# Altium schematic sheet FI_10_7.SchDoc
size A4
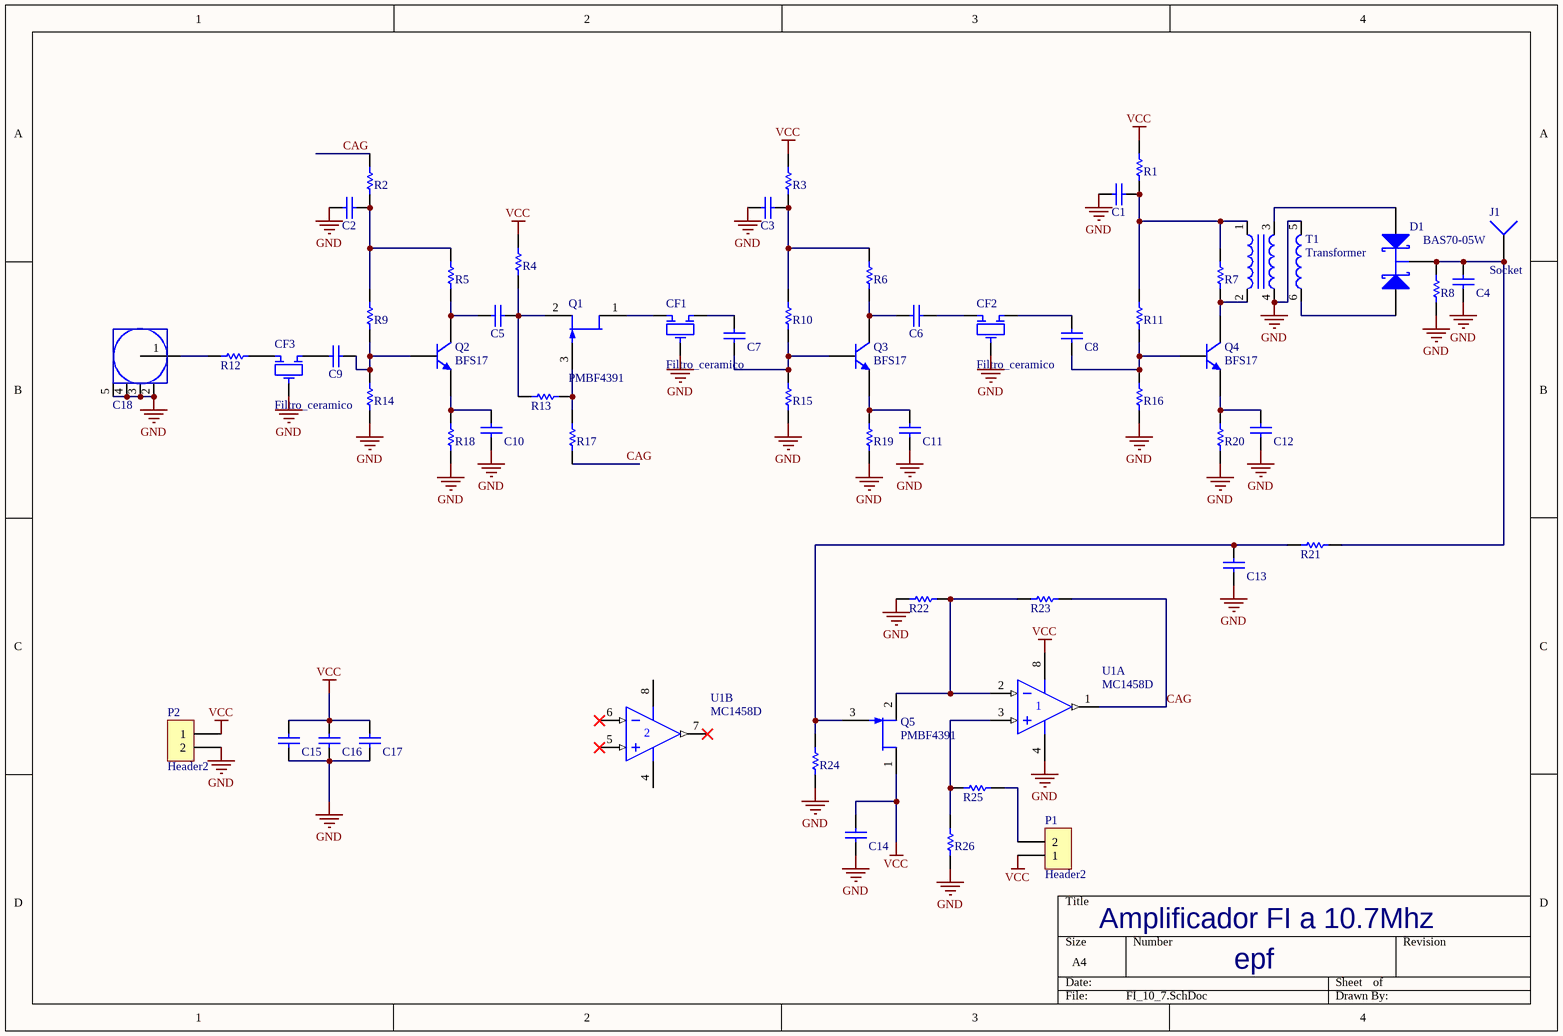
[diagram p0: FI_10_7.SchDoc]

## Parts
C1  Capacitor  [0805_CAP]  (value not drawn)
C2  Capacitor  [0805_CAP]  (value not drawn)
C3  Capacitor  [0805_CAP]  (value not drawn)
C4  Capacitor  [0805_CAP]  (value not drawn)
C5  Capacitor  [0805_CAP]  (value not drawn)
C6  Capacitor  [0805_CAP]  (value not drawn)
C7  Capacitor  [0805_CAP]  (value not drawn)
C8  Capacitor  [0805_CAP]  (value not drawn)
C9  Capacitor  [0805_CAP]  (value not drawn)
C10  Capacitor  [0805_CAP]  (value not drawn)
C11  Capacitor  [0805_CAP]  (value not drawn)
C12  Capacitor  [0805_CAP]  (value not drawn)
C13  Capacitor  [0805_CAP]  (value not drawn)
C14  Capacitor  [0805_CAP]  (value not drawn)
C15  Capacitor  [0805_CAP]  (value not drawn)
C16  Capacitor  [0805_CAP]  (value not drawn)
C17  Capacitor  [0805_CAP]  (value not drawn)
C18  SMA  [SMAL2]  (value not drawn)
CF1  Filtro_ceramico  [Filter_10_7]
CF2  Filtro_ceramico  [Filter_10_7]
CF3  Filtro_ceramico  [Filter_10_7]
D1  BAS70-05W  [SOT323_N]
J1  Socket  [PIN1]
P1  Header2  [Header2Hembra]
P2  Header2  [Header2Hembra]
Q1  PMBF4391  [SOT23]
Q2  BFS17  [SOT23]
Q3  BFS17  [SOT23]
Q4  BFS17  [SOT23]
Q5  PMBF4391  [SOT23]
R1  Resistor  [0805_RES]  (value not drawn)
R2  Resistor  [0805_RES]  (value not drawn)
R3  Resistor  [0805_RES]  (value not drawn)
R4  Resistor  [0805_RES]  (value not drawn)
R5  Resistor  [0805_RES]  (value not drawn)
R6  Resistor  [0805_RES]  (value not drawn)
R7  Resistor  [0805_RES]  (value not drawn)
R8  Resistor  [0805_RES]  (value not drawn)
R9  Resistor  [0805_RES]  (value not drawn)
R10  Resistor  [0805_RES]  (value not drawn)
R11  Resistor  [0805_RES]  (value not drawn)
R12  Resistor  [0805_RES]  (value not drawn)
R13  Resistor  [0805_RES]  (value not drawn)
R14  Resistor  [0805_RES]  (value not drawn)
R15  Resistor  [0805_RES]  (value not drawn)
R16  Resistor  [0805_RES]  (value not drawn)
R17  Resistor  [0805_RES]  (value not drawn)
R18  Resistor  [0805_RES]  (value not drawn)
R19  Resistor  [0805_RES]  (value not drawn)
R20  Resistor  [0805_RES]  (value not drawn)
R21  Resistor  [0805_RES]  (value not drawn)
R22  Resistor  [0805_RES]  (value not drawn)
R23  Resistor  [0805_RES]  (value not drawn)
R24  Resistor  [0805_RES]  (value not drawn)
R25  Resistor  [0805_RES]  (value not drawn)
R26  Resistor  [0805_RES]  (value not drawn)
T1  Transformer  [NTH12_V_3Ind_2]
U1  MC1458D  [751-05_M]  (parts A,B of 2)

## Nets
GND: C1.2 C2.2 C3.2 C4.1 C10.1 C11.1 C12.1 C13.1 C14.1 C15.1 C16.1 C17.1 C18.2(GND) C18.3(GND) C18.4(GND) C18.5(GND) CF1.2 CF2.2 CF3.2 P2.2 R8.2 R14.2 R15.2 R16.2 R18.2 R19.2 R20.2 R22.1 R24.1 R26.1 T1.4 T1.5 U1.4(V-)
VCC: C14.2 C15.2 C16.2 C17.2 P1.1 P2.1 Q5.1(D) R1.1 R3.1 R4.1 U1.8(V+)
CAG: R2.1 R17.1 R23.2 U1.1(OUT)
NetC1_1: C1.1 R1.2 R7.1 R11.1 T1.1
NetC2_1: C2.1 R2.2 R5.1 R9.1
NetC3_1: C3.1 R3.2 R6.1 R10.1
NetC4_2: C4.2 D1.3(K) J1.1 R8.1 R21.2
NetC5_1: C5.1 Q1.2(S) R4.2 R13.2
NetC5_2: C5.2 Q2.3(C) R5.2
NetC6_1: C6.1 CF2.1
NetC6_2: C6.2 Q3.3(C) R6.2
NetC7_1: C7.1 CF1.3
NetC7_2: C7.2 Q3.1(B) R10.2 R15.1
NetC8_1: C8.1 Q4.1(B) R11.2 R16.1
NetC8_2: C8.2 CF2.3
NetC9_1: C9.1 Q2.1(B) R9.2 R14.1
NetC9_2: C9.2 CF3.3
NetC10_2: C10.2 Q2.2(E) R18.1
NetC11_2: C11.2 Q3.2(E) R19.1
NetC12_2: C12.2 Q4.2(E) R20.1
NetC13_2: C13.2 Q5.3(G) R21.1 R24.2
NetC18_1: C18.1(RF) R12.1
NetCF1_1: CF1.1 Q1.1(D)
NetCF3_1: CF3.1 R12.2
NetD1_1: D1.1(A1) T1.3
NetD1_2: D1.2(A2) T1.6
NetP1_2: P1.2 R25.2
NetQ1_3: Q1.3(G) R13.1 R17.2
NetQ4_3: Q4.3(C) R7.2 T1.2
NetQ5_2: Q5.2(S) R22.2 R23.1 U1.2(IN-)
NetR25_1: R25.1 R26.2 U1.3(IN+)

Not connected (* = marked no-connect by the designer): U1 5(IN+)* 6(IN-)* 7(OUT)*

## Notes on the sheet
- Amplificador FI a 10.7Mhz
- epf

## Library data of the parts
C1-C17 = Cap
CF1-CF3 = Filter_10_7
D1 = BAS70-05W: Schottky Barrier Double Diode; Published: 17-Sep-2003; LatestRevisionDate: 12-Dec-2006; LatestRevisionNote: IPC-7351 Footprint Added.; DatasheetVersion: 26-Mar-1999; PackageVersion: Apr-1999; PackageReference: SOT323; Publisher: Altium Limited; PackageDescription: 3-Pin SOT-323 Package 0.65 mm Pitch, 2.1 mm Lead Span; ComponentLink1Description: Manufacturer Link; ComponentLink1URL: http://www.semiconductors.philips.com/; ComponentLink2Description: Datasheet; ComponentLink2URL: http://www.semiconductors.philips.com/acrobat/datasheets/BAS70W_3.pdf
Q1 Q5 = PMBF4391: N-channel Silicon Junction Field-effect Transistor; Published: 17-Sep-2003; LatestRevisionDate: 12-Dec-2006; LatestRevisionNote: IPC-7351 Footprint Added.; DatasheetVersion: Apr-1995; PackageVersion: May-1999; PackageReference: SOT23; Publisher: Altium Limited; PackageDescription: 3-Pin SOT-23 Package 0.95 mm Pitch, 2.3 mm Lead Span; ComponentLink1Description: Manufacturer Link; ComponentLink1URL: http://www.semiconductors.philips.com/; ComponentLink2Description: Datasheet; ComponentLink2URL: http://www.semiconductors.philips.com/acrobat/datasheets/PMBF4391_4392_4393_CNV_2.pdf
Q2-Q4 = BFS17: NPN 1 GHz Wideband Transistor; Published: 17-Sep-2003; LatestRevisionDate: 12-Dec-2006; LatestRevisionNote: IPC-7351 Footprint Added.; DatasheetVersion: Sep-1995; PackageVersion: May-1999; PackageReference: SOT23; Publisher: Altium Limited; PackageDescription: 3-Pin SOT-23 Package 0.95 mm Pitch, 2.3 mm Lead Span; ComponentLink1Description: Manufacturer Link; ComponentLink1URL: http://www.semiconductors.philips.com/; ComponentLink2Description: Datasheet; ComponentLink2URL: http://www.semiconductors.philips.com/acrobat/datasheets/BFS17_2.pdf
R1-R26 = Res
T1 = Transformador3: Transformador 3 bobinas
U1 = MC1458D: Dual Operational Amplifier, Internally Compensated; Published: 17-Jul-2002; LatestRevisionDate: 13-Apr-2006; LatestRevisionNote: IPC-7351 Footprint Added.; DatasheetVersion: 1996; PackageVersion: 1996; PackageReference: 751-05; Publisher: Altium Limited; PackageDescription: 8-Pin Small Outline Integrated Circuit 1.27 mm Pitch; Code_JEDEC: MS-012-AA; Code_IPC: SOIC127P600-8; ComponentLink1Description: Manufacturer Link; ComponentLink1URL: http://www.onsemi.com/site/products/parametrics/0,4446,251,00.html
J1 = Socket: LatestRevisionDate: 17-Jul-2002; LatestRevisionNote: Re-released for DXP Platform.; Publisher: Altium Limited